# EAGLE schematic main (EAGLE 9.5.0)
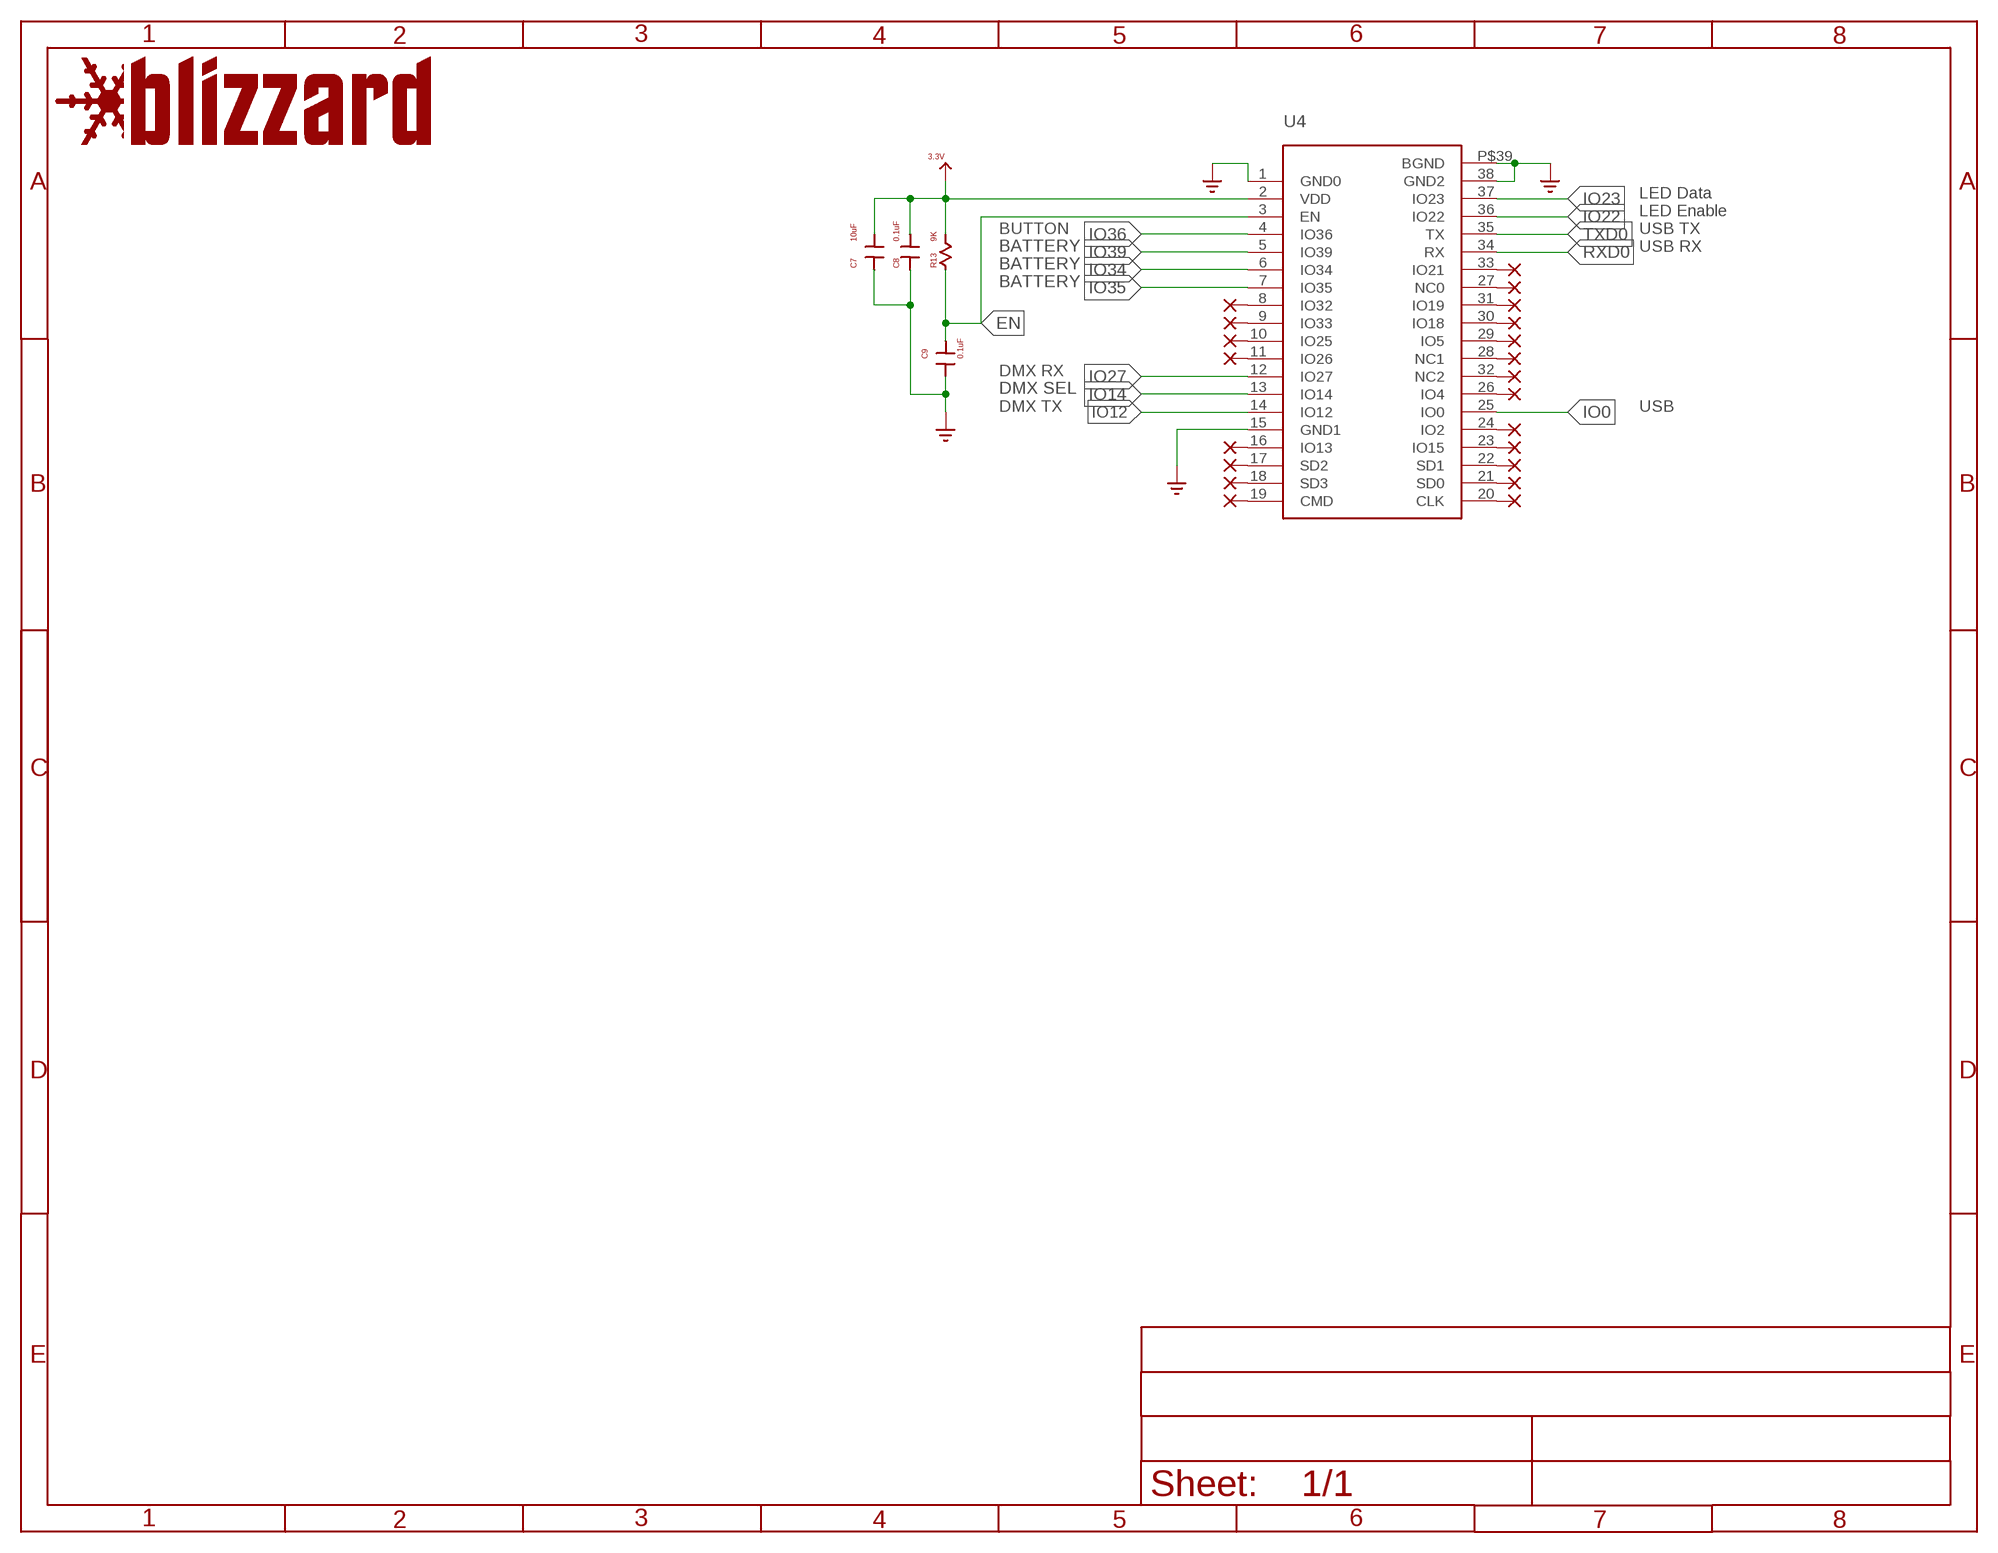
[diagram p0: schematic, sheet 1]

## Parts
C7  10uF  0603_CAP_DEV3D  [CAPC1508X55]
C8  0.1uF  0603_CAP_DEV3D  [CAPC1508X55]
C9  0.1uF  0603_CAP_DEV3D  [CAPC1508X55]
GND11  GND  (no package)
GND12  GND  (no package)
GND13  GND  (no package)
GND14  GND  (no package)
NC1  NC  (no package)
NC2  NC  (no package)
NC3  NC  (no package)
NC4  NC  (no package)
NC5  NC  (no package)
NC6  NC  (no package)
NC7  NC  (no package)
NC8  NC  (no package)
NC9  NC  (no package)
NC10  NC  (no package)
NC11  NC  (no package)
NC12  NC  (no package)
NC21  NC  (no package)
NC22  NC  (no package)
NC23  NC  (no package)
NC24  NC  (no package)
NC25  NC  (no package)
NC26  NC  (no package)
NC27  NC  (no package)
NC28  NC  (no package)
NC29  NC  (no package)
R13  9K  0603_RES_DEV3D  [RESC1608X55]
U4  ESP_32_WROVER_I_PKG  [ESP32_WROVER_I_PKG]
VCC11  3.3V  VCC  (no package)

## Nets
3.3V: C7.2 C8.2 R13.2 U4.2(VDD) VCC11.P$1
EN: C9.2 R13.1 U4.3(EN)
GND: C7.1 C8.1 C9.1 GND11.P$1 GND12.P$1 GND13.P$1 GND14.P$1 U4.1(GND0) U4.15(GND1) U4.38(GND2) U4.P$39(BGND)
IO0: U4.25(IO0)
IO12: U4.14(IO12)
IO14: U4.13(IO14)
IO22: U4.36(IO22)
IO23: U4.37(IO23)
IO27: U4.12(IO27)
IO34: U4.6(IO34)
IO35: U4.7(IO35)
IO36: U4.4(IO36)
IO39: U4.5(IO39)
N$1: NC7.P$1 U4.17(SD2)
N$3: NC9.P$1 U4.18(SD3)
N$11: NC21.P$1 U4.8(IO32)
N$15: NC22.P$1 U4.9(IO33)
N$16: NC23.P$1 U4.10(IO25)
N$17: NC24.P$1 U4.11(IO26)
N$18: NC25.P$1 U4.16(IO13)
N$21: NC11.P$1 U4.19(CMD)
N$22: NC12.P$1 U4.20(CLK)
N$23: NC10.P$1 U4.21(SD0)
N$24: NC8.P$1 U4.22(SD1)
N$25: NC6.P$1 U4.23(IO15)
N$26: NC5.P$1 U4.24(IO2)
N$27: NC4.P$1 U4.32(NC2)
N$28: NC3.P$1 U4.28(NC1)
N$29: NC2.P$1 U4.29(IO5)
N$30: NC1.P$1 U4.27(NC0)
N$36: NC26.P$1 U4.26(IO4)
N$38: NC27.P$1 U4.30(IO18)
N$39: NC28.P$1 U4.31(IO19)
N$40: NC29.P$1 U4.33(IO21)
RXD0: U4.34(RX)
TXD0: U4.35(TX)

## Notes on the sheet
- LED Data
- LED Enable
- BUTTON | USB TX
- BATTERY | USB RX
- BATTERY
- BATTERY
- DMX RX
- DMX SEL
- DMX TX | USB

## Library data of the parts
C7-C9 = Blizzard_Library:0603_CAP_DEV: 0603 Capacitor
GND11-GND14 = Blizzard_Library:GND: GROUND
NC1-NC12 NC21-NC29 = Blizzard_Library:NC: NC
R13 = Blizzard_Library:0603_RES_DEV: 0603 Resister
U4 = Blizzard_Library:ESP_32_WROVER_I_PKG: ESP32-WROVER-I; PN: GC-ESP-WROVER-32
VCC11 = Blizzard_Library:VCC: VCC